# EAGLE design BR85_MKL_3309_Lichtplatine_hinten_V3 (EAGLE 5.10)
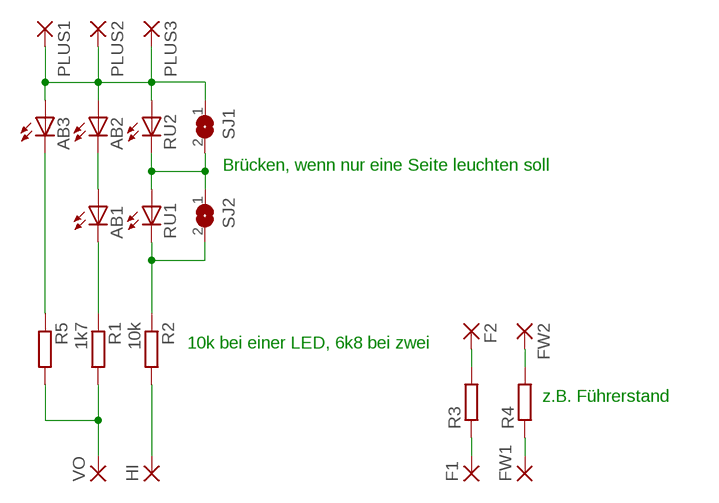
[diagram p0: schematic, sheet 1]

## Parts
AB1  LEDCHIP-LED0603  [CHIP-LED0603]
AB2  LEDCHIP-LED0603  [CHIP-LED0603]
AB3  LEDCHIP-LED0603  [CHIP-LED0603]
F1  SMD2  [SMD1,27-2,54]
F2  SMD2  [SMD1,27-2,54]
FW1  SMD2  [SMD1,27-2,54]
FW2  SMD2  [SMD1,27-2,54]
HI  SMD2  [SMD1,27-2,54]
PLUS1  SMD2  [SMD1,27-2,54]
PLUS2  SMD2  [SMD1,27-2,54]
PLUS3  SMD2  [SMD1,27-2,54]
R1  1k7  R-EU_R0603S  [R0603S]
R2  10k  R-EU_R0603S  [R0603S]
R3  R-EU_R0603S  [R0603S]
R4  R-EU_R0603S  [R0603S]
R5  R-EU_R0603S  [R0603S]
RU1  LEDCHIP-LED0603  [CHIP-LED0603]
RU2  LEDCHIP-LED0603  [CHIP-LED0603]
SJ1  SJSS  [SJS]
SJ2  SJSS  [SJS]
VO  SMD2  [SMD1,27-2,54]

## Nets
N$1: AB1.A AB2.C
N$2: R1.2 R5.2 VO.1(P)
N$3: RU1.A RU2.C SJ1.2 SJ2.1
N$4: AB3.C R5.1
N$5: AB1.C R1.1
N$6: HI.1(P) R2.2
N$8: F1.1(P) R3.1
N$9: FW1.1(P) R4.1
N$10: AB2.A AB3.A PLUS1.1(P) PLUS2.1(P) PLUS3.1(P) RU2.A SJ1.1
N$11: F2.1(P) R3.2
N$12: FW2.1(P) R4.2
N$13: R2.1 RU1.C SJ2.2

## Notes on the sheet
- Brücken, wenn nur eine Seite leuchten soll
- 10k bei einer LED, 6k8 bei zwei
- z.B. Führerstand

## Library data of the parts
AB1-AB3 RU1 RU2 = led:LED: LED OSRAM: - CHIPLED LG R971, LG N971, LY N971, LG Q971, LY Q971, LO R971, LY R971 LH N974, LH R974 LS Q976, LO Q976, LY Q976 LO Q996 - Hyper CHIPLED LW Q18S LB Q993, LB Q99A, LB R99A - SideLED LS A670, LO A670, LY A670, LG A670, LP A670 LB A673, LV A673, LT A673, LW A673 LH A674 LY A675 LS A676, LA A676, LO A676, LY A676, LW A676 LS A679, LY A679, LG A679 - Hyper Micro SIDELED® LS Y876, LA Y876, LO Y876, LY Y876 LT Y87S - SmartLED LW L88C, LW L88S LB L89C, LB L89S, LG L890 LS L89K, LO L89K, LY L89K LS L896, LA L896, LO L896, LY L896 - TOPLED LS T670, LO T670, LY T670, LG T670, LP T670 LSG T670, LSP T670, LSY T670, LOP T670, LYG T670 LG T671, LOG T671, LSG T671 LB T673, LV T673, LT T673, LW T673 LH T674 LS T676, LA T676, LO T676, LY T676, LB T676, LH T676, LSB T676, LW T676 LB T67C, LV T67C, LT T67C, LS T67K, LO T67K, LY T67K, LW E67C LS E67B, LA E67B, LO E67B, LY E67B, LB E67C, LV E67C, LT E67C LW T67C LS T679, LY T679, LG T679 LS T770, LO T770, LY T770, LG T770, LP T770 LB T773, LV T773, LT T773, LW T773 LH T774 LS E675, LA E675, LY E675, LS T675 LS T776, LA T776, LO T776, LY T776, LB T776 LHGB T686 LT T68C, LB T68C - Hyper Mini TOPLED® LB M676 - Mini TOPLED Santana® LG M470 LS M47K, LO M47K, LY M47K Source: http://www.osram.convergy.de LUXEON: - LUMILED® LXK2-PW12-R00, LXK2-PW12-S00, LXK2-PW14-U00, LXK2-PW14-V00 LXK2-PM12-R00, LXK2-PM12-S00, LXK2-PM14-U00 LXK2-PE12-Q00, LXK2-PE12-R00, LXK2-PE12-S00, LXK2-PE14-T00, LXK2-PE14-U00 LXK2-PB12-K00, LXK2-PB12-L00, LXK2-PB12-M00, LXK2-PB14-N00, LXK2-PB14-P00, LXK2-PB14-Q00 LXK2-PR12-L00, LXK2-PR12-M00, LXK2-PR14-Q00, LXK2-PR14-R00 LXK2-PD12-Q00, LXK2-PD12-R00, LXK2-PD12-S00 LXK2-PH12-R00, LXK2-PH12-S00 LXK2-PL12-P00, LXK2-PL12-Q00, LXK2-PL12-R00 Source: www.luxeon.com KINGBRIGHT: KA-3528ASYC Source: www.kingbright.com
F1 F2 FW1 FW2 HI PLUS1-PLUS3 VO = wirepad:SMD2: SMD PAD
R1-R5 = rcl:R-EU_: RESISTOR, European symbol
SJ1 SJ2 = jumper:SJS

## Board
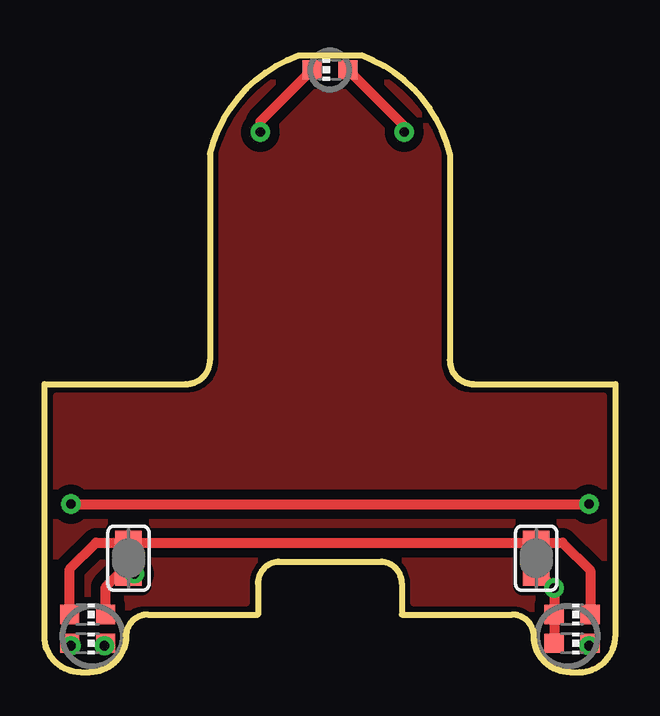
[diagram p1: board, top side]
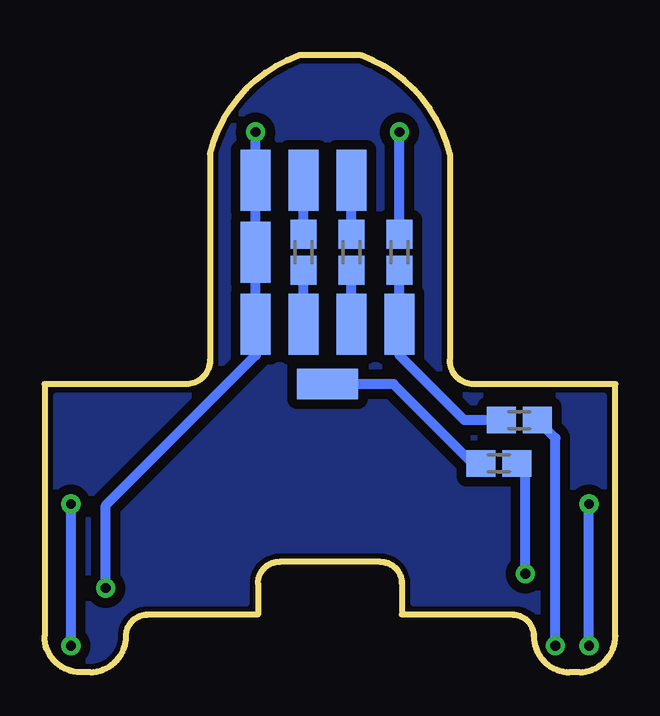
[diagram p2: board, bottom side, seen from below]

No outline drawn. Coordinates in mm, seen from the top.
Copper layers (1*16): Top 0.035mm / dielectric 1.5mm / Bottom 0.035mm
Design rules "default *": minimum track width 7mil, minimum drill 0.4mm, track to track 8mil, track to pad 8mil, pad to pad 8mil, via to via 8mil, smd to smd 8mil, copper to edge 40mil, drill to drill 8mil, minimum pad ring 10mil, minimum via ring 8mil, stop-mask expansion 4mil, vias tented up to drill 0mil, thermal gap 10mil
Milling: 26 lines

### Footprints (pad centres in the part's own frame; a part is rotated, then mirrored left to right if it is on the bottom)
CHIP-LED0603 = smd 0.8 x 0.8: A 0,-0.75; C 0,0.75
SMD1,27-2,54 = smd 1.27 x 2.54: 1 0,0
R0603S = smd 1.2 x 1.1: 1 -0.75,0; 2 0.75,0
SJS = smd 1 x 1.1: 1 -0.65,0; 2 0.65,0

### Placement (x,y rotation side)
AB1  1.3,1.2 270 top
AB2  21.5,1.2 270 top
AB3  11.4,25.1 90 top
F1  12.5,14.5 180 bottom
F2  12.5,20.5 180 bottom
FW1  10.5,14.5 180 bottom
FW2  10.5,20.5 180 bottom
HI  11.5,12 90 bottom
PLUS1  14.5,20.5 180 bottom
PLUS2  14.5,17.5 0 bottom
PLUS3  14.5,14.5 180 bottom
R1  3.5,10.5 180 bottom
R2  4.35,8.7 180 bottom
R3  12.5,17.5 90 bottom
R4  10.5,17.5 90 bottom
R5  8.5,17.5 270 bottom
RU1  1.3,2.4 270 top
RU2  21.5,2.4 270 top
SJ1  20,4.75 90 top
SJ2  3,4.75 270 top
VO  8.5,14.5 180 bottom

### Tracks (layer width: path | path; a pad name or v marks a point on that pad's centre or on a via)
N$1  (via drill 0.4)
  Top 0.406: AB2.C 22.25,1.1 v22.2,1.1 | v0.6,7 v22.2,7 | AB1.A 0.55,1.15 v0.6,1.1
  Bottom 0.406: v22.2,7 v22.2,1.1 | v0.6,1.1 v0.6,7
N$2
  Bottom 0.406: R5.2 VO.1 8.5,13.2 5.8,10.5 R1.2
N$3
  Top 0.406: RU2.C 22.25,4.25 21.1,5.4 SJ1.2 SJ2.1 1.65,5.4 0.55,4.3 RU1.A
N$4  (via drill 0.4)
  Top 0.406: v8.5,22.5 8.5,22.95 AB3.C
  Bottom 0.406: R5.1 v8.5,22.5
N$5  (via drill 0.4)
  Top 0.406: v2,1.1 2,1.15 AB1.C
  Bottom 0.406: v2,1.1 2,9.75 R1.1
N$6
  Bottom 0.406: R2.2 5.45,8.7 8.75,12 HI.1
N$7
  pour Bottom (isolate 0.406): 10.2,25.2 arc53 6.9,21.6 6.9,13 arc-90 5.5,11.5 0,11.5 0,1.5 arc90 1,0.5 1.3,0.5 arc90 2.3,1.5 arc-90 3.7,2.9 7.9,2.9 7.9,3.7 arc-90 9.3,5.1 13.5,5.1 arc-90 14.9,3.7 14.9,2.9 19,2.9 arc-90 20.4,1.5 arc90 21.4,0.5 21.8,0.5 arc90 22.8,1.5 22.8,11.5 17.3,11.5 arc-90 15.9,12.9 15.9,21.6 arc53 12.6,25.2
  pour Top (isolate 0.406): 10.2,25.2 arc53 6.9,21.6 6.9,13 arc-90 5.5,11.5 0,11.5 0,1.5 arc90 1,0.5 1.3,0.5 arc90 2.3,1.5 arc-90 3.7,2.9 7.9,2.9 7.9,3.7 arc-90 9.3,5.1 13.5,5.1 arc-90 14.9,3.7 14.9,2.9 19,2.9 arc-90 20.4,1.5 arc90 21.4,0.5 21.8,0.5 arc90 22.8,1.5 22.8,11.5 17.3,11.5 arc-90 15.9,12.9 15.9,21.6 arc53 12.6,25.2
N$8
  Bottom 0.406: F1.1 R3.1
N$9
  Bottom 0.406: FW1.1 R4.1
N$10  (via drill 0.4)
  Top 0.254: AB2.A 20.91,1.04 20.95,1.04
  Top 0.406: AB2.A RU2.A v20.75,3.5 20.15,4.1 SJ1.1 | AB3.A 14.5,22.75 v14.5,22.5
  Bottom 0.406: v14.5,22.5 PLUS1.1 PLUS2.1 PLUS3.1 14.5,13.2 20.75,6.95 v20.75,3.5
N$11
  Bottom 0.406: R3.2 F2.1
N$12
  Bottom 0.406: R4.2 FW2.1
N$13  (via drill 0.4)
  Top 0.406: RU1.C 2.05,3.55 2.6,4.1 SJ2.2 v3.25,4.1
  Bottom 0.406: v3.25,4.1 3.25,8.35 R2.1

### Text on the board
tStop: BR85 LED | Für Märklin 3309 | design by Janik Merz
bStop: BR85 LED | + | w | r